# EasyEDA schematic SCH_rocket-launcher_2024-12-23.json
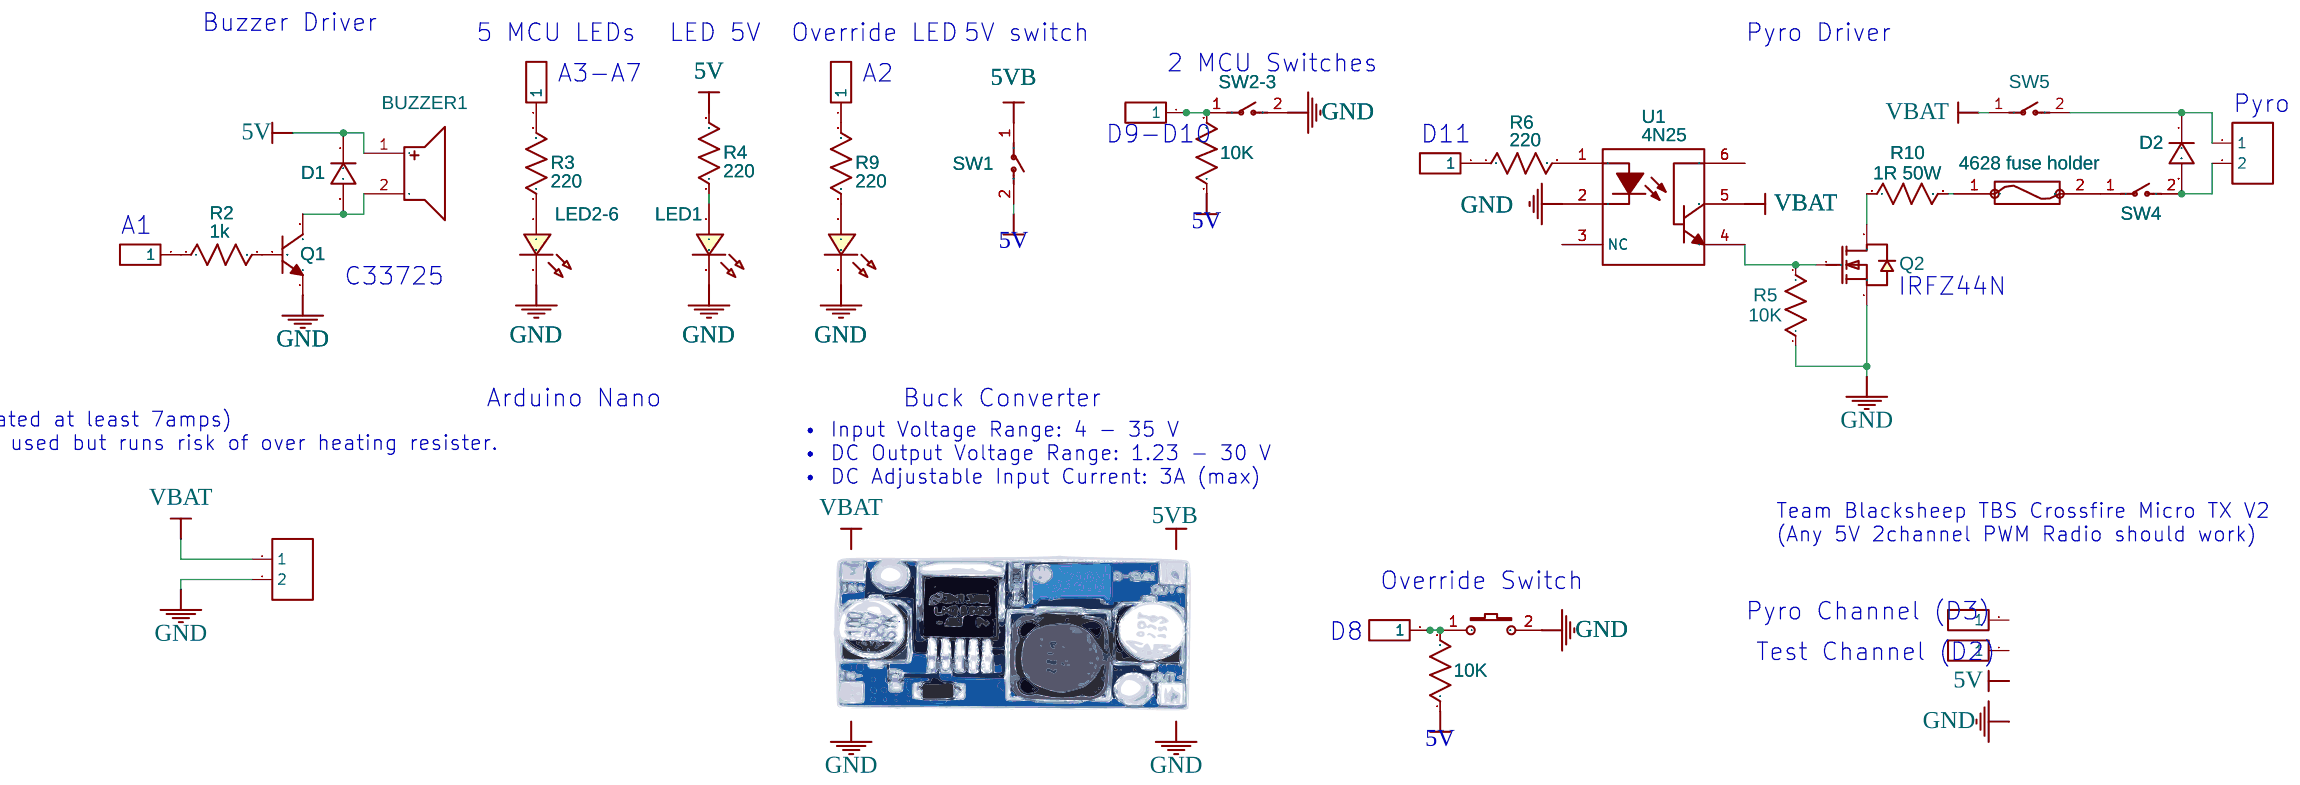
[diagram p0: schematic sheet]

## Parts
BUZZER1  HND-13065B  [BUZ-SMD_L12.8-W12.8-LS13.8]
D1  1N4007W  [SOD-123_L2.8-W1.8-LS3.7-RD]
D2  1N4007W  [SOD-123_L2.8-W1.8-LS3.7-RD]
J1  HDR-M-2.54_1x1  [HDR-M-2.54_1X1]
J2-1  HDR-M-2.54_1x1  [HDR-M-2.54_1X1]
J2-6  HDR-M-2.54_1x1  [HDR-M-2.54_1X1]
J7-1  HDR-M-2.54_1x1  [HDR-M-2.54_1X1]
J7-8  HDR-M-2.54_1x1  [HDR-M-2.54_1X1]
J9  HDR-M-2.54_1x1  [HDR-M-2.54_1X1]
J9#2  HDR-M-2.54_1x1  [HDR-M-2.54_1X1]
J10  HDR-M-2.54_1x1  [HDR-M-2.54_1X1]
KEY1  K2-3.6×6.1_SMD  [KEY-SMD_2P-L6.2-W3.6-LS8.0]
LED1  LED-0603_R  [LED0603_RED]
LED2-1  LED-0603_R  [LED0603_RED]
LED2-6  LED-0603_R  [LED0603_RED]
P1  CONN-TH_2P-P5.00  [CONN-TH_2P-P5.00]
P2  CONN-TH_2P-P5.00  [CONN-TH_2P-P5.00]
Q1  2N3904(SOT-23)  [SOT-23-3_L2.9-W1.3-P1.90-LS2.4-TR]
Q2  2N7002  [SOT-23_L2.9-W1.3-P0.95-LS2.4-BR]
R2  1k  [R0603]
R3  220  [R0603]
R4  220  [R0603]
R5  10K  [R0603]
R6  220  [R0603]
R7  10K  [R0603]
R8  10K  [R0603]
R9  220  [R0603]
R10  1R 50W  [R0603]
SW1  KCD11-2P-R  [SW-TH_2P-L15.0-W10.5-P5.00_KCD11-2P-R]
SW2-3  KCD11-2P-R  [SW-TH_2P-L15.0-W10.5-P5.00_KCD11-2P-R]
SW4  KCD11-2P-R  [SW-TH_2P-L15.0-W10.5-P5.00_KCD11-2P-R]
SW5  KCD11-2P-R  [SW-TH_2P-L15.0-W10.5-P5.00_KCD11-2P-R]
U1  4N25  [DIP-6_L7.3-W6.5-P2.54-LS7.6-BL]
U2  4628 fuse holder  [4628 FUSE HOLDER FOOT PRINT]

## Library data of the parts
BUZZER1 = HND-13065B: Contributor: LCSC; Supplier: LCSC; Supplier Part: C96126; Manufacturer: 华能; JLCPCB Part Class: Extended Part
D1 D2 = 1N4007W: Supplier: LCSC; Supplier Part: C328592; Manufacturer: BLUE ROCKET; Contributor: LCEDA_Lib
J1 J2-1 J2-6 J7-1 J7-8 J9 J9#2 J10 = HDR-M-2.54_1x1: Supplier Part: C81276; Supplier: LCSC; Contributor: LCEDA_Lib
KEY1 = K2-3.6×6.1_SMD: Supplier Part: C118141; Supplier: LCSC; Manufacturer Part: K2-1107ST-A4SW-06; Contributor: LCEDA_Lib; 制造商: 韩国韩荣
LED1 LED2-1 LED2-6 = LED-0603_R: Manufacturer: EVERLIGHT(台湾亿光); Manufacturer Part: 19-217/R6C-AL1M2VY/3T; Supplier Part: C72044; Supplier: LCSC; Contributor: LCEDA_01
P1 P2 = CONN-TH_2P-P5.00: Supplier: LCSC; Contributor: LCEDA_Lib
Q1 = 2N3904(SOT-23): Supplier: LCSC; Manufacturer: KEC; Manufacturer Part: 2n3904S-RTK/PS; Supplier Part: C18536; Paste Type: SOT-23; Contributor: LCEDA_Lib
Q2 = 2N7002: Supplier: LCSC; Manufacturer: Nexperia; Manufacturer Part: 2N7002,215; image: //image.lceda.cn/szlcsc/C65189.jpg; Supplier Part: C65189; Paste Type: expand; Contributor: LCEDA_Lib
R2-R10 = R_0603_US: Contributor: LCEDA_Lib
SW1 SW2-3 SW4 SW5 = KCD11-2P-R: Supplier: LCSC; Supplier Part: C5884414; Manufacturer: SHOU HAN(首韩); JLCPCB Part Class: Extended Part; Contributor: lcsc
U1 = 4N25: Contributor: LCSC; Supplier: LCSC; Manufacturer: EVERLIGHT(亿光); Supplier Part: C115480; JLCPCB Part Class: Extended Part
U2 = 4628 fuse holder: Manufacturer: Keystone; Manufacturer Part: 4628C; Contributor: brendanb2024

## Nets
5V: BUZZER1.1 D1.1 R4.2 R7.1 R8.1 SW1.2
5VB: SW1.1
GND: KEY1.2 LED1.2 LED2-1.2 LED2-6.2 P2.2 Q1.1(E) Q2.2(S) R5.1 SW2-3.2 U1.2
VBAT: P2.1 SW5.1 U1.5
Net-(BUZZER1-2): BUZZER1.2 D1.2 Q1.3(C)
Net-(D2-1): D2.1 P1.1 SW5.2
Net-(D2-2): D2.2 P1.2 SW4.2
Net-(J1-1): J1.1 R2.1
Net-(J2-1-1): J2-1.1 R9.2
Net-(J2-6-1): J2-6.1 R3.2
Net-(J7-1-1): J7-1.1 KEY1.1 R8.2
Net-(J7-8-1): J7-8.1 R7.2 SW2-3.1
Net-(J9-1): J9.1 R6.1
Net-(LED1-1): LED1.1 R4.1
Net-(LED2-1-1): LED2-1.1 R9.1
Net-(LED2-6-1): LED2-6.1 R3.1
Net-(Q1-2): Q1.2(B) R2.2
Net-(Q2-1): Q2.1(G) R5.2 U1.4
Net-(Q2-3): Q2.3(D) R10.1
Net-(R6-2): R6.2 U1.1
Net-(R10-2): R10.2 U2.1
Net-(SW4-1): SW4.1 U2.2

Not connected (* = marked no-connect by the designer): J9#2 1; J10 1; U1 3(NC) 6

## Notes on the sheet
- Buzzer Driver
- 5 MCU LEDs
- LED 5V
- Override LED
- 5V switch
- Pyro Driver
- A3-A7
- A2
- 2 MCU Switches
- Pyro
- D9-D10
- D11
- A1
- C33725
- IRFZ44N
- Arduino Nano
- Buck Converter
- Battery 2s liion/lipo (rated at least 7amps)
  12v car battery may be used but runs risk of over heating resister.
- • Input Voltage Range: 4 - 35 V
  • DC Output Voltage Range: 1.23 - 30 V
  • DC Adjustable Input Current: 3A (max)
- Team Blacksheep TBS Crossfire Micro TX V2
  (Any 5V 2channel PWM Radio should work)
- Override Switch
- D8
- Pyro Channel (D3)
- Test Channel (D2)
